# Altium schematic sheet FPGA1.SchDoc: Animated Archer Main PCB
size Letter; Author: John Eric Martin; Engineer: John Eric Martin; Organization: UCCS IEEE Robotics; Address1: 1420 Austin Bluffs Pkwy; Address2: Colorado Springs, CO 80918; DocumentNumber: FPGA1; Revision: 1; SheetNumber: 3; SheetTotal: 10; ProjectName: Animated Archer Quadcopter
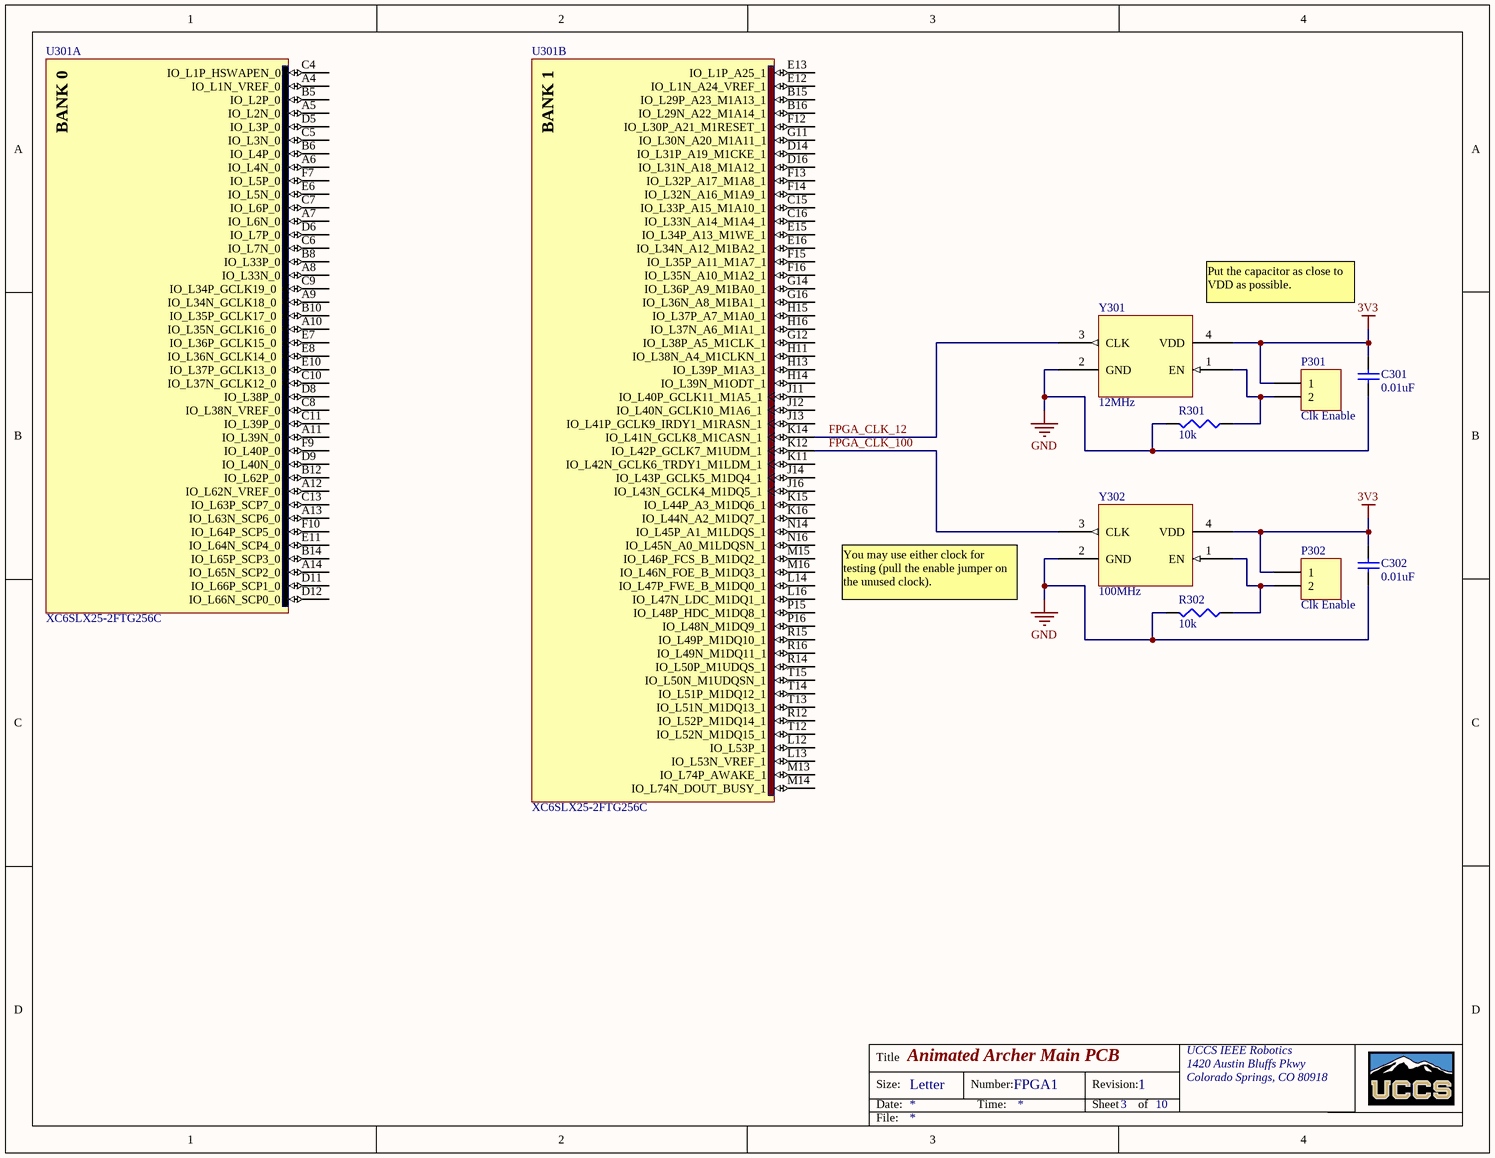
[diagram p0: FPGA1.SchDoc]

## Parts
C301  value 0.01uF  [1608[0603]]  (hidden comment: Cap Semi)
C302  value 0.01uF  [1608[0603]]  (hidden comment: Cap Semi)
P301  Clk Enable  [HDR1X2]
P302  Clk Enable  [HDR1X2]
R301  value 10k  [J1-0603]  (hidden comment: Res3)
R302  value 10k  [J1-0603]  (hidden comment: Res3)
U301  XC6SLX25-2FTG256C  [FTG256]  (parts A,B of 7)
Y301  12MHz  [ASFLMB]
Y302  100MHz  [ASFLMB]

## Nets
3V3: C301.2 C302.2 P301.1 P302.1 Y301.4(VDD) Y302.4(VDD)
GND: C301.1 C302.1 R301.2 R302.2 Y301.2(GND) Y302.2(GND)
FPGA_CLK_12: U301.K14(IO_L41N_GCLK8_M1CASN_1) Y301.3(CLK)
FPGA_CLK_100: U301.K12(IO_L42P_GCLK7_M1UDM_1) Y302.3(CLK)
NetP301_2: P301.2 R301.1 Y301.1(EN)
NetP302_2: P302.2 R302.1 Y302.1(EN)

Not connected (* = marked no-connect by the designer): U301 A4(IO_L1N_VREF_0) A5(IO_L2N_0) A6(IO_L4N_0) A7(IO_L6N_0) A8(IO_L33N_0) A9(IO_L34N_GCLK18_0) A10(IO_L35N_GCLK16_0) A11(IO_L39N_0) A12(IO_L62N_VREF_0) A13(IO_L63N_SCP6_0) A14(IO_L65N_SCP2_0) B5(IO_L2P_0) B6(IO_L4P_0) B8(IO_L33P_0) B10(IO_L35P_GCLK17_0) B12(IO_L62P_0) B14(IO_L65P_SCP3_0) B15(IO_L29P_A23_M1A13_1) B16(IO_L29N_A22_M1A14_1) C4(IO_L1P_HSWAPEN_0) C5(IO_L3N_0) C6(IO_L7N_0) C7(IO_L6P_0) C8(IO_L38N_VREF_0) C9(IO_L34P_GCLK19_0) C10(IO_L37N_GCLK12_0) C11(IO_L39P_0) C13(IO_L63P_SCP7_0) C15(IO_L33P_A15_M1A10_1) C16(IO_L33N_A14_M1A4_1) D5(IO_L3P_0) D6(IO_L7P_0) D8(IO_L38P_0) D9(IO_L40N_0) D11(IO_L66P_SCP1_0) D12(IO_L66N_SCP0_0) D14(IO_L31P_A19_M1CKE_1) D16(IO_L31N_A18_M1A12_1) E6(IO_L5N_0) E7(IO_L36P_GCLK15_0) E8(IO_L36N_GCLK14_0) E10(IO_L37P_GCLK13_0) E11(IO_L64N_SCP4_0) E12(IO_L1N_A24_VREF_1) E13(IO_L1P_A25_1) E15(IO_L34P_A13_M1WE_1) E16(IO_L34N_A12_M1BA2_1) F7(IO_L5P_0) F9(IO_L40P_0) F10(IO_L64P_SCP5_0) F12(IO_L30P_A21_M1RESET_1) F13(IO_L32P_A17_M1A8_1) F14(IO_L32N_A16_M1A9_1) F15(IO_L35P_A11_M1A7_1) F16(IO_L35N_A10_M1A2_1) G11(IO_L30N_A20_M1A11_1) G12(IO_L38P_A5_M1CLK_1) G14(IO_L36P_A9_M1BA0_1) G16(IO_L36N_A8_M1BA1_1) H11(IO_L38N_A4_M1CLKN_1) H13(IO_L39P_M1A3_1) H14(IO_L39N_M1ODT_1) H15(IO_L37P_A7_M1A0_1) H16(IO_L37N_A6_M1A1_1) J11(IO_L40P_GCLK11_M1A5_1) J12(IO_L40N_GCLK10_M1A6_1) J13(IO_L41P_GCLK9_IRDY1_M1RASN_1) J14(IO_L43P_GCLK5_M1DQ4_1) J16(IO_L43N_GCLK4_M1DQ5_1) K11(IO_L42N_GCLK6_TRDY1_M1LDM_1) K15(IO_L44P_A3_M1DQ6_1) K16(IO_L44N_A2_M1DQ7_1) L12(IO_L53P_1) L13(IO_L53N_VREF_1) L14(IO_L47P_FWE_B_M1DQ0_1) L16(IO_L47N_LDC_M1DQ1_1) M13(IO_L74P_AWAKE_1) M14(IO_L74N_DOUT_BUSY_1) M15(IO_L46P_FCS_B_M1DQ2_1) M16(IO_L46N_FOE_B_M1DQ3_1) N14(IO_L45P_A1_M1LDQS_1) N16(IO_L45N_A0_M1LDQSN_1) P15(IO_L48P_HDC_M1DQ8_1) P16(IO_L48N_M1DQ9_1) R12(IO_L52P_M1DQ14_1) R14(IO_L50P_M1UDQS_1) R15(IO_L49P_M1DQ10_1) R16(IO_L49N_M1DQ11_1) T12(IO_L52N_M1DQ15_1) T13(IO_L51N_M1DQ13_1) T14(IO_L51P_M1DQ12_1) T15(IO_L50N_M1UDQSN_1)

## Notes on the sheet
- (near Y301) Put the capacitor as close to VDD as possible.
- You may use either clock for testing (pull the enable jumper on the unused clock).
- Title
- Size:
- Date:
- Letter
- Number:
- Time:
- Revision:
- Sheet
- of
- File:
- (in symbol XC6SLX25-2FTG256C, part A) BANK 0
- (in symbol XC6SLX25-2FTG256C, part B) BANK 1

## Library data of the parts
C301 C302 = Cap Semi: Capacitor (Semiconductor SIM Model); Published: 8-Jun-2000; LatestRevisionDate: 29-May-2009; LatestRevisionNote: IPC-7351 Footprint Added.; PackageReference: C1206; Publisher: Altium Limited; PackageDescription: Chip Capacitor
P301 P302 = Header 2: Header, 2-Pin; LatestRevisionDate: 17-Jul-2002; LatestRevisionNote: Re-released for DXP Platform.; Publisher: Altium Limited
R301 R302 = Res3: Resistor; Published: 8-Jun-2000; LatestRevisionDate: 29-May-2009; LatestRevisionNote: IPC-7351 Footprint Added.; PackageReference: J1-0603; Publisher: Altium Limited; PackageDescription: Chip Resistor
U301 = XC6SLX25-2FTG256C: Spartan-6 LX 1.2V FPGA, 186 User I/Os, 256-Ball Fine-Pitch Thin BGA (1.0mm Pitch), Speed Grade 2, Commercial Grade, Pb-Free; Published: 17-Nov-2009; DatasheetVersion: ver1.6, Nov-2010; PackageVersion: ver1.3, Oct-2007; PackageReference: FTG256; Publisher: Altium Limited; PackageDescription: 256-Ball Fine Pitch Thin Ball Grid Array 1.00 mm Pitch (FTG256) - Pb-Free; Supplier 1: Digi-Key; Supplier Part Number 1: XC6SLX25-2FTG256C-ND; Code_JEDEC: MS-034-AAF-1*; ComponentLink1Description: Manufacturer Link; ComponentLink1URL: http://www.xilinx.com; ComponentLink2Description: Spartan-6 Datasheet; ComponentLink2URL: http://www.xilinx.com/support/documentation/data_sheets/ds160.pdf; ComponentLink3Description: Spartan-6 Documents; ComponentLink3URL: http://www.xilinx.com/support/documentation/spartan-6.htm; ComponentLink4Description: Xilinx.com Home; ComponentLink4URL: http://www.xilinx.com
Y301 Y302 = ASFLMB: ASFLMB Clock Oscillator